# Altium schematic sheet POWER.SchDoc
size A4
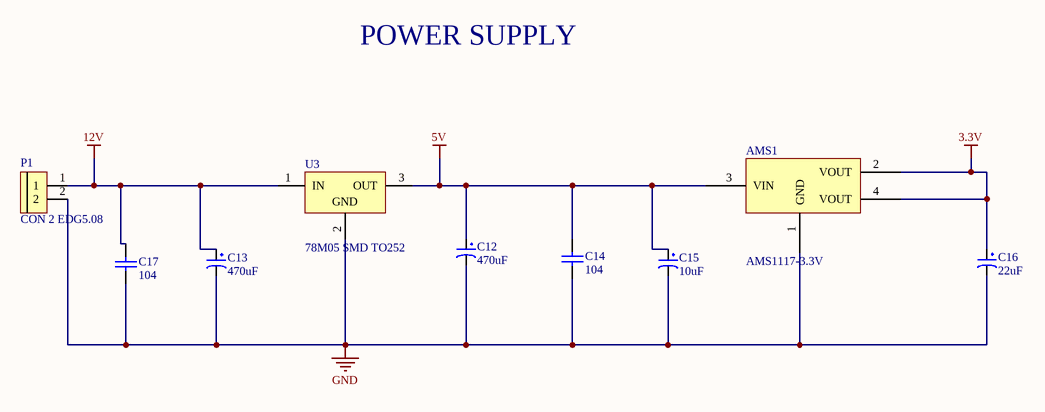
[diagram p0: POWER.SchDoc]

## Parts
AMS1  AMS1117-3.3V  [SOT223]
C12  470uF  [tu hoa 8mm]
C13  470uF  [tu hoa 8mm]
C14  104  [tu 1206]
C15  10uF  [tu tantalum smd3216]
C16  22uF  [tu tantalum smd6032]
C17  104  [tu 1206]
P1  CON 2 EDG5.08  [CON 2 2EDG5.08]
U3  78M05 SMD TO252  [TO252]

## Nets
3.3V: AMS1.2(VOUT) AMS1.4(VOUT) C16.1
5V: AMS1.3(VIN) C12.1 C14.1 C15.1 U3.3(OUT)
12V: C13.1 C17.1 P1.1 U3.1(IN)
GND: AMS1.1(GND) C12.2 C13.2 C14.2 C15.2 C16.2 C17.2 P1.2 U3.2(GND)

## Notes on the sheet
- POWER SUPPLY

## Library data of the parts
AMS1 = AMS1117 SMD: Dán; Value: AMS1117-3.3V SOT223; Don_Vi: Con; Ma_Hang: MH000596; Ghi_Chu: *; Kieu_Chan: *; Chung_Loai: Dán
C12 C13 = Tu Hoa 470uF 16V 8x11: Cắm; Don_Vi: Con; So_Chan: 2; Ten_Linh_Kien: Tụ Hóa 470uF 16V 8x11MM; Ma_Hang: MH006550; Chung_Loai: Cắm; Kieu_Chan: *
C14 C17 = Tu 1206 104 50V 20%: Dán; Don_Vi: Con; So_Chan: 2; Ten_Linh_Kien: Tụ 1206 104-0.1uF 20% 50V; Ma_Hang: MH004544; Chung_Loai: Dán; Kieu_Chan: *
C15 = Tu tantalum 10uF 16V SMD3216: Dán; Don_Vi: Con; So_Chan: 2; Ten_Linh_Kien: Tụ tantalum 106C-10uF 16V SMD3216; Ma_Hang: MH001954; Chung_Loai: Dán; Kieu_Chan: *
C16 = Tu tantalum 22uF 25V SMD6032: Dán; Don_Vi: Con; So_Chan: 2; Ten_Linh_Kien: Tụ tantalum 226E-22uF 25V SMD6032; Ma_Hang: MH002651; Chung_Loai: Dán; Kieu_Chan: *
P1 = CON 2 EDG5.08: Cắm; Ten_Linh_Kien: CON 2 2EDG5.08-2P 5.08MM ( Xanh Cong); Ma_Hang: MH000759; Ghi_Chu: *; Don_Vi: Con; Kieu_Chan: *; Chung_Loai: Cắm
U3 = 78M05 SMD TO252: Dán; Don_Vi: Con; Ten_Linh_Kien: 78M05 TO252; Ma_Hang: MH001917; Ghi_Chu: *; Kieu_Chan: *; Chung_Loai: Dán